# EAGLE schematic axiom_beta_plugin_module_eMMC_v0.1 (EAGLE 7.7.0)
Assembly variants: Beta
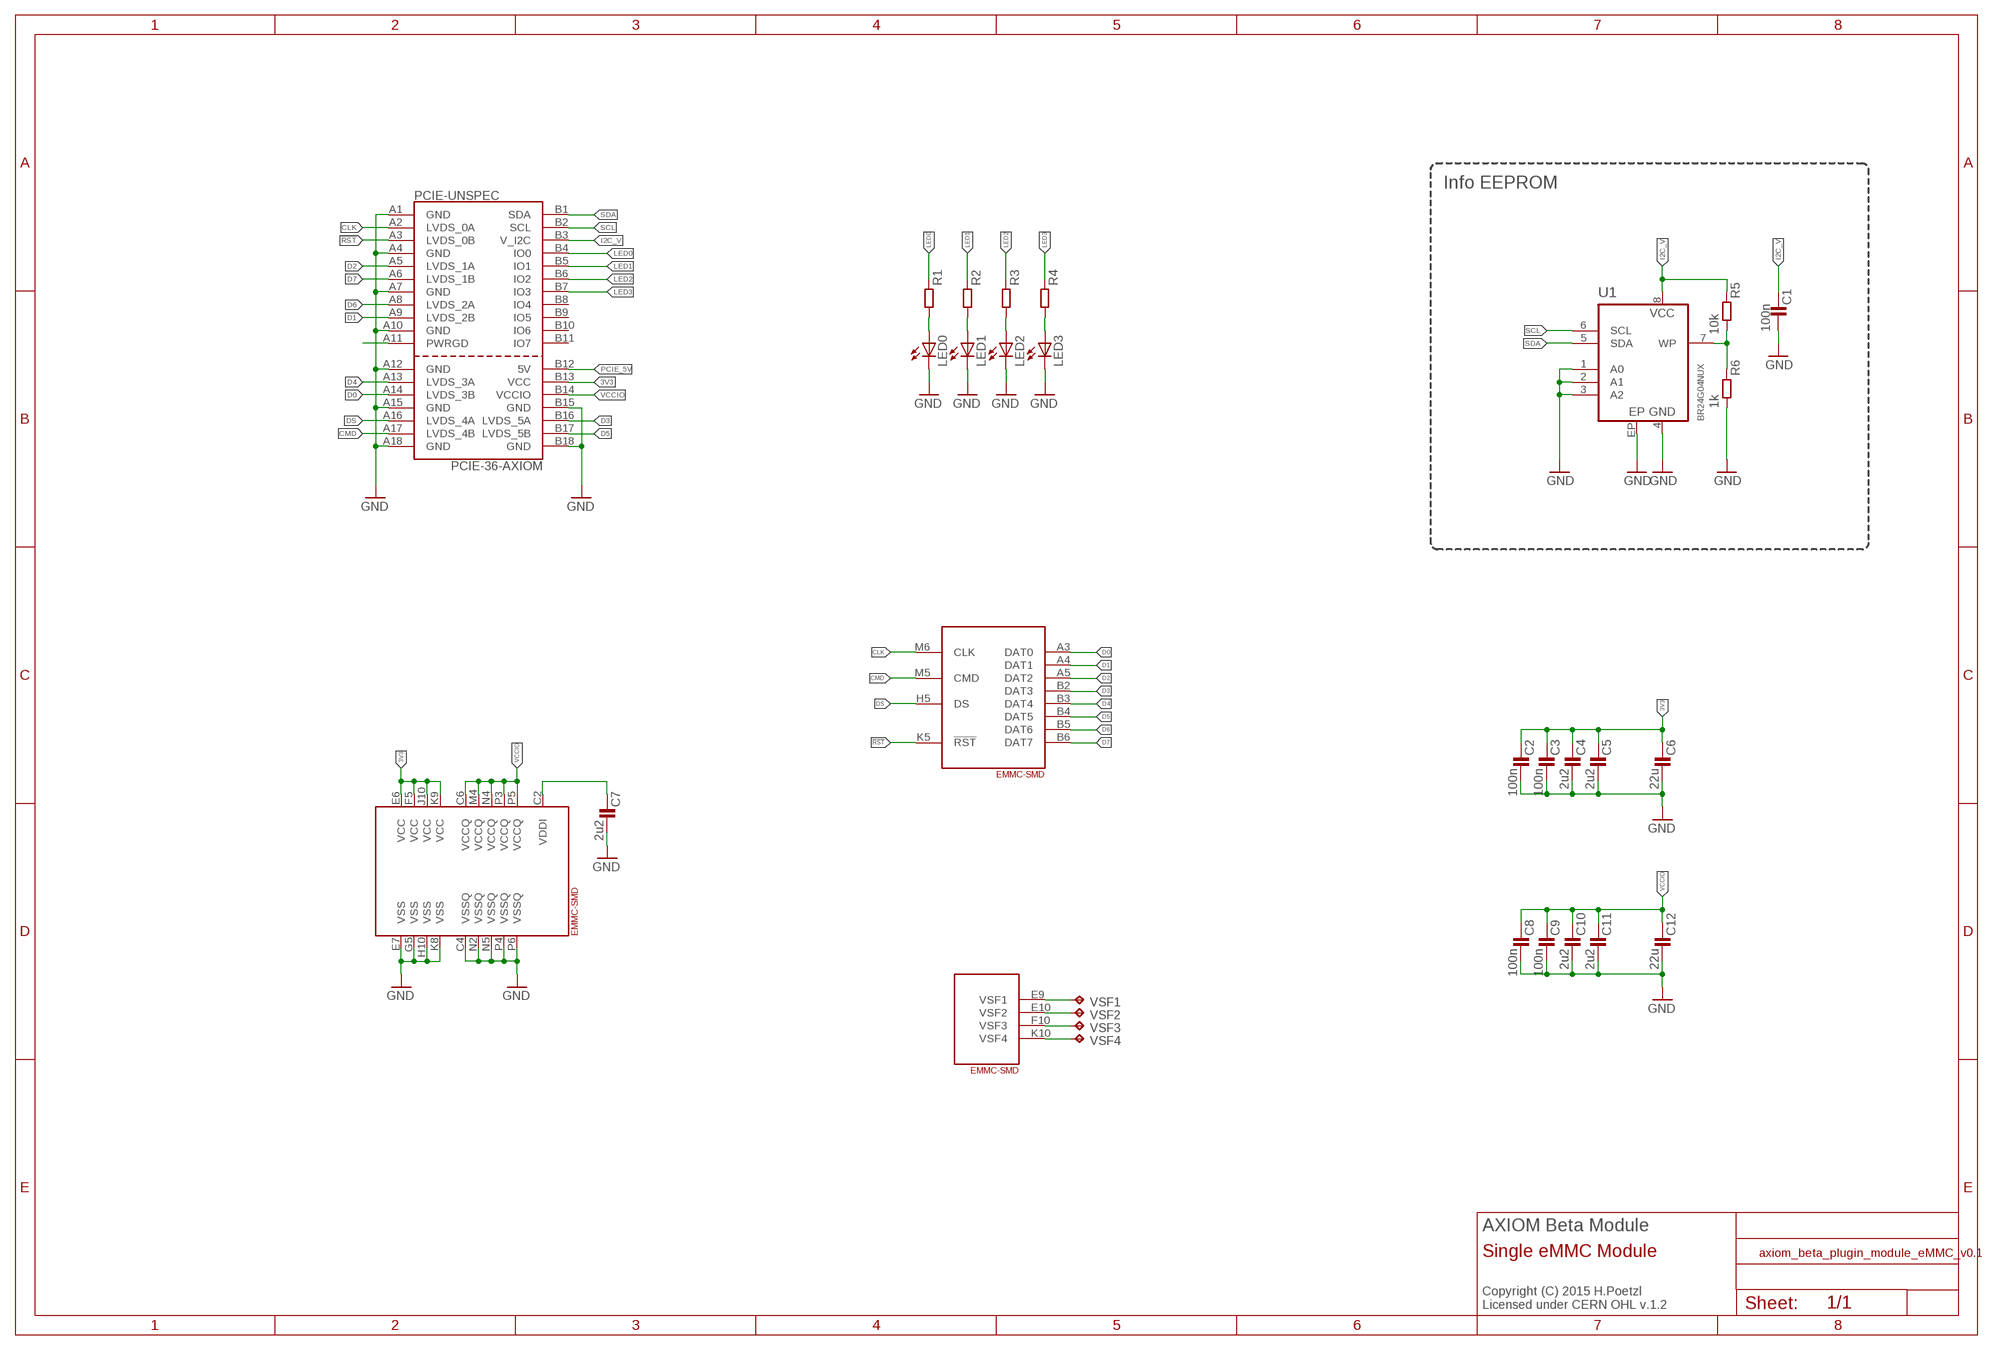
[diagram p0: schematic, sheet 1]

## Parts
C1  100n  C0402-C  [0402-C]
C2  100n  C0201-C  [0201-C]
C3  100n  C0201-C  [0201-C]
C4  2u2  C0201-C  [0201-C]
C5  2u2  C0201-C  [0201-C]
C6  22u  C0805-C  [0805-C]
C7  2u2  C0201-C  [0201-C]
C8  100n  C0201-C  [0201-C]
C9  100n  C0201-C  [0201-C]
C10  2u2  C0201-C  [0201-C]
C11  2u2  C0201-C  [0201-C]
C12  22u  C0805-C  [0805-C]
LED0  LED  [CHIPLED_0603]
LED1  LED  [CHIPLED_0603]
LED2  LED  [CHIPLED_0603]
LED3  LED  [CHIPLED_0603]
PCIE-UNSPEC  PCIE-36-AXIOM  [PCIE-36-AXIOM]  (not fitted in variant Beta)
R1  R0402-C  [0402-C]
R2  R0402-C  [0402-C]
R3  R0402-C  [0402-C]
R4  R0402-C  [0402-C]
R5  10k  R0402-C  [0402-C]
R6  1k  R0402-C  [0402-C]
U1  BR24G04NUX  [DFN200X300X100-9N]
U$1  EMMC-SMD  [FBGA153-SMD]
VSF1  TPTP06SQ  [TP06SQ]
VSF2  TPTP06SQ  [TP06SQ]
VSF3  TPTP06SQ  [TP06SQ]
VSF4  TPTP06SQ  [TP06SQ]

## Nets
3V3: C2.1 C3.1 C4.1 C5.1 C6.1 PCIE-UNSPEC.B13(VCC) U$1.E6(POWER:VCC) U$1.F5(POWER:VCC) U$1.J10(POWER:VCC) U$1.K9(POWER:VCC)
!RST: PCIE-UNSPEC.A3(LVDS_0B) U$1.K5(BUS:!RST)
CLK: PCIE-UNSPEC.A2(LVDS_0A) U$1.M6(BUS:CLK)
CMD: PCIE-UNSPEC.A17(LVDS_4B) U$1.M5(BUS:CMD)
D0: PCIE-UNSPEC.A14(LVDS_3B) U$1.A3(BUS:DAT0)
D1: PCIE-UNSPEC.A9(LVDS_2B) U$1.A4(BUS:DAT1)
D2: PCIE-UNSPEC.A5(LVDS_1A) U$1.A5(BUS:DAT2)
D3: PCIE-UNSPEC.B16(LVDS_5A) U$1.B2(BUS:DAT3)
D4: PCIE-UNSPEC.A13(LVDS_3A) U$1.B3(BUS:DAT4)
D5: PCIE-UNSPEC.B17(LVDS_5B) U$1.B4(BUS:DAT5)
D6: PCIE-UNSPEC.A8(LVDS_2A) U$1.B5(BUS:DAT6)
D7: PCIE-UNSPEC.A6(LVDS_1B) U$1.B6(BUS:DAT7)
DS: PCIE-UNSPEC.A16(LVDS_4A) U$1.H5(BUS:DS)
GND: C1.2 C2.2 C3.2 C4.2 C5.2 C6.2 C7.2 C8.2 C9.2 C10.2 C11.2 C12.2 LED0.C LED1.C LED2.C LED3.C PCIE-UNSPEC.A1(GND) PCIE-UNSPEC.A4(GND) PCIE-UNSPEC.A7(GND) PCIE-UNSPEC.A10(GND) PCIE-UNSPEC.A12(GND) PCIE-UNSPEC.A15(GND) PCIE-UNSPEC.A18(GND) PCIE-UNSPEC.B15(GND) PCIE-UNSPEC.B18(GND) R6.2 U1.1(A0) U1.2(A1) U1.3(A2) U1.4(GND) U1.EP U$1.C4(POWER:VSSQ) U$1.E7(POWER:VSS) U$1.G5(POWER:VSS) U$1.H10(POWER:VSS) U$1.K8(POWER:VSS) U$1.N2(POWER:VSSQ) U$1.N5(POWER:VSSQ) U$1.P4(POWER:VSSQ) U$1.P6(POWER:VSSQ)
I2C_V: C1.1 PCIE-UNSPEC.B3(V_I2C) R5.1 U1.8(VCC)
LED0: PCIE-UNSPEC.B4(IO0) R1.1
LED1: PCIE-UNSPEC.B5(IO1) R2.1
LED2: PCIE-UNSPEC.B6(IO2) R3.1
LED3: PCIE-UNSPEC.B7(IO3) R4.1
N$1: LED0.A R1.2
N$2: LED1.A R2.2
N$3: LED2.A R3.2
N$4: LED3.A R4.2
N$12: R5.2 R6.1 U1.7(WP)
N$14: U$1.E9(VENDOR:VSF1) VSF1.TP
N$15: U$1.E10(VENDOR:VSF2) VSF2.TP
N$16: U$1.F10(VENDOR:VSF3) VSF3.TP
N$17: U$1.K10(VENDOR:VSF4) VSF4.TP
N$209: PCIE-UNSPEC.A11(PWRGD)
PCIE_5V: PCIE-UNSPEC.B12(5V)
SCL: PCIE-UNSPEC.B2(SCL) U1.6(SCL)
SDA: PCIE-UNSPEC.B1(SDA) U1.5(SDA)
VCCIO: C8.1 C9.1 C10.1 C11.1 C12.1 PCIE-UNSPEC.B14(VCCIO) U$1.C6(POWER:VCCQ) U$1.M4(POWER:VCCQ) U$1.N4(POWER:VCCQ) U$1.P3(POWER:VCCQ) U$1.P5(POWER:VCCQ)
VDDI: C7.1 U$1.C2(POWER:VDDI)
Unconnected: PCIE-UNSPEC.B8(IO4) PCIE-UNSPEC.B9(IO5) PCIE-UNSPEC.B10(IO6) PCIE-UNSPEC.B11(IO7)

## Notes on the sheet
- Info EEPROM
- AXIOM Beta Module
- Single eMMC Module
- Copyright (C) 2015 H.Poetzl
  Licensed under CERN OHL v.1.2

## Library data of the parts
C1-C12 = generic-rcl:C
LED0 LED1-LED3 = led:LED
PCIE-UNSPEC = PCIe:PCIE-36-AXIOM
R1-R6 = generic-rcl:R
U1 = eeprom:BR24G04
U$1 = emmc:EMMC
VSF1-VSF4 = testpad:TP: Test pad

## Net classes
0 default: width 0.127 mm, drill 0.203 mm
1 power: width 0.254 mm, drill 0.203 mm